# Altium schematic sheet Sheet1.SchDoc
size B; SheetNumber: 1; SheetTotal: 2
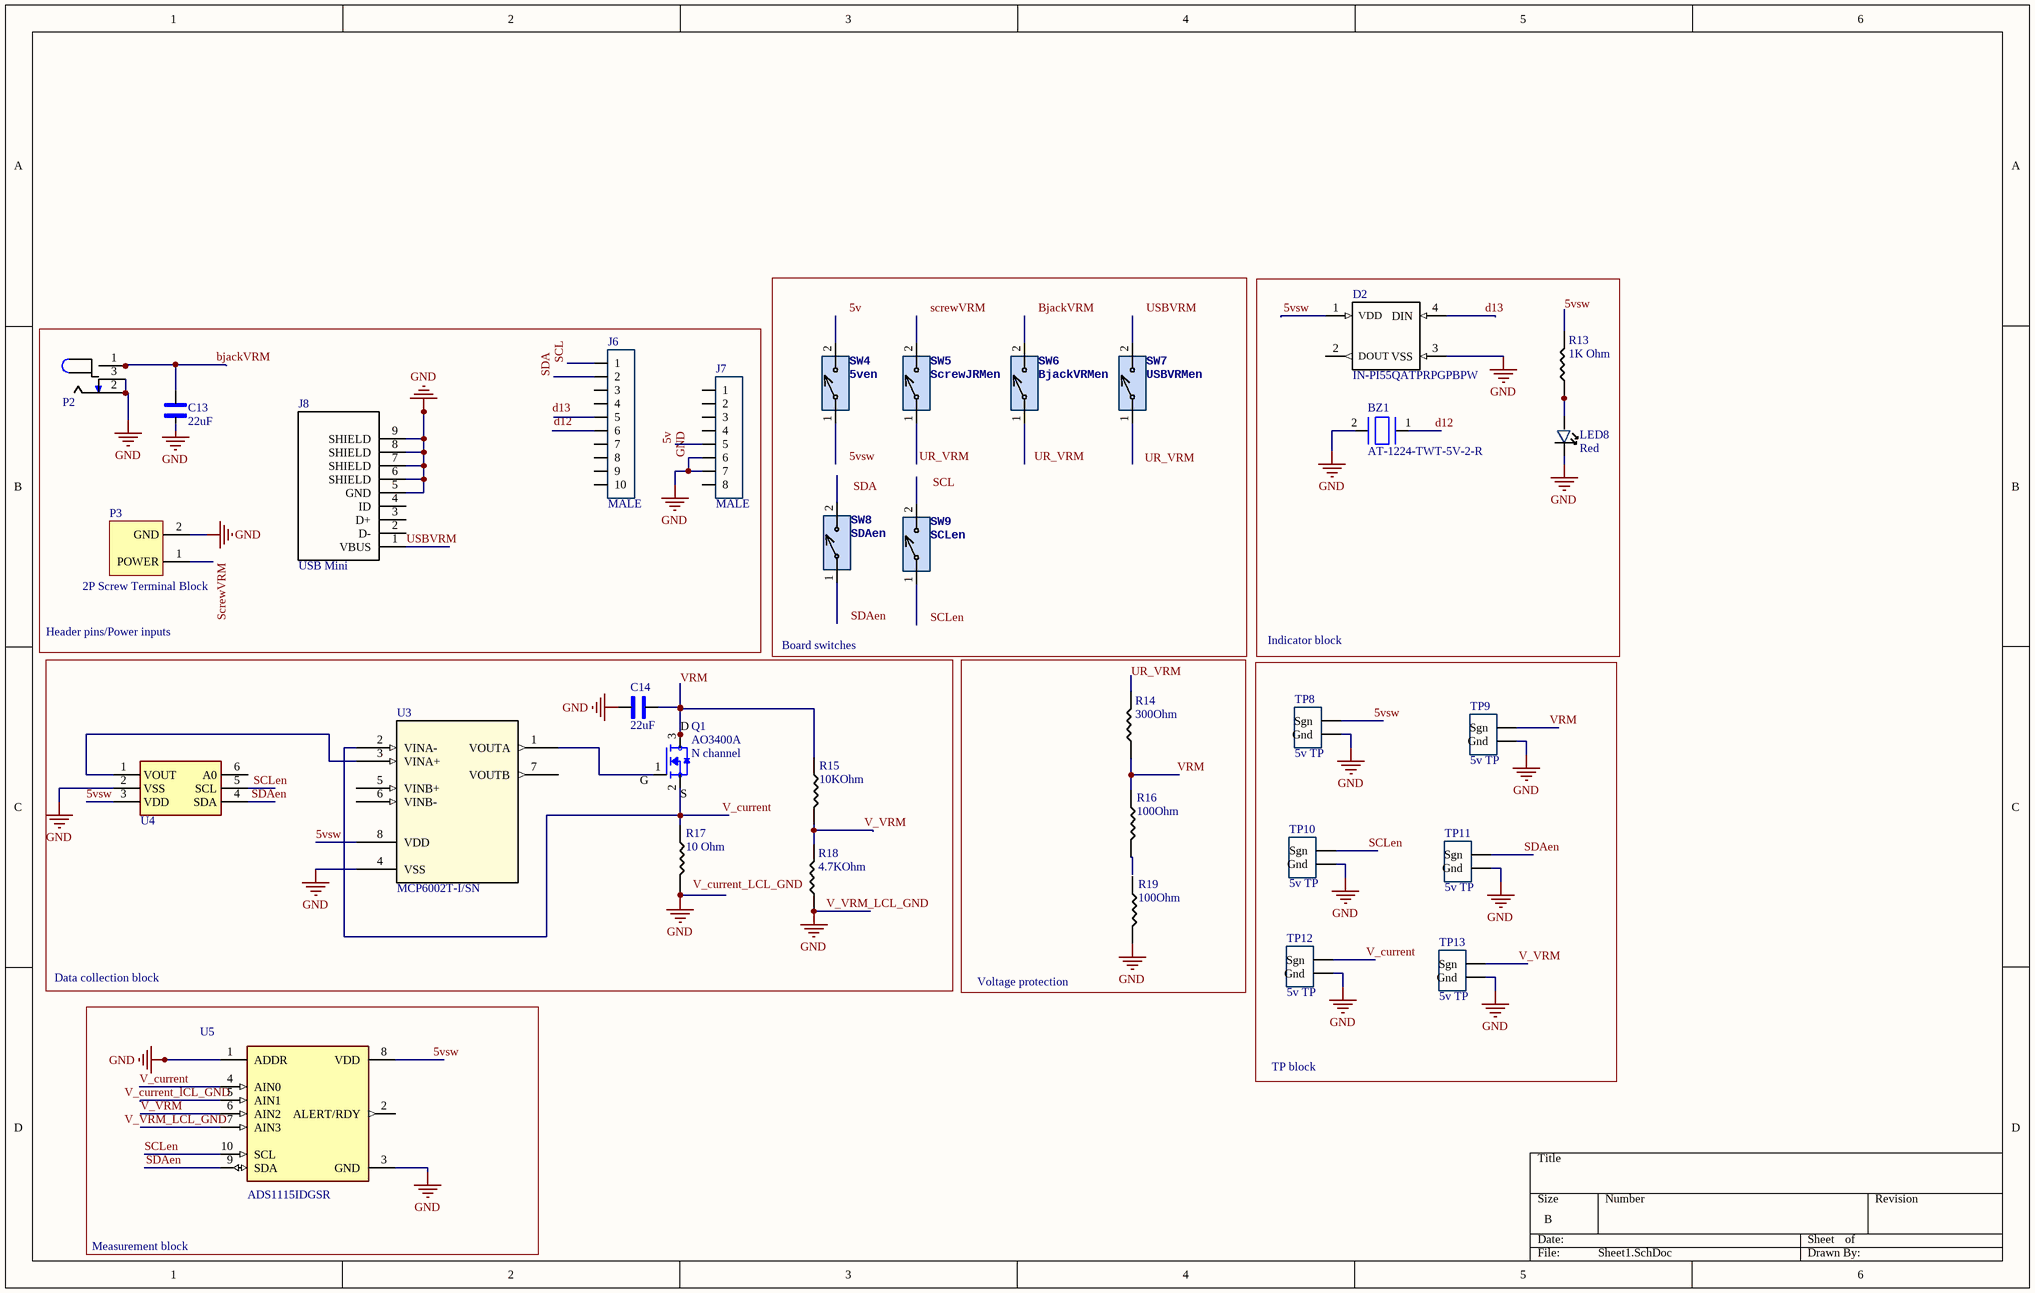
[diagram p0: Sheet1.SchDoc]

## Parts
BZ1  AT-1224-TWT-5V-2-R  [BUZZER- TH]
C13  22uF  [1206_Passive_Capacitor]
C14  22uF  [1206_Passive_Capacitor]
D2  IN-PI55QATPRPGPBPW  [SERIAL_LED - duplicate]
J6  value MALE  [10_PIN_100MIL-Male]  (hidden comment: MALE 10PIN)
J7  value MALE  [8_PIN_100MIL-Male]  (hidden comment: MALE 8PIN)
J8  USB Mini  [USB_MINI_B]
LED8  Red  [LED_1206]
P2  Power Jack  [Power_Jack]  (value not drawn)
P3  2P Screw Terminal Block  [P_Terminal block 3.5mm-pitch]
Q1  AO3400A  value N channel  [N-MOSFET]
R13  value 1K Ohm  [1206_Passive_Resitor]  (hidden comment: 1k)
R14  value 300Ohm  [1206_Passive_Resitor]  (hidden comment: 300 Ohm)
R15  value 10KOhm  [1206_Passive_Resitor]  (hidden comment: 10k)
R16  100Ohm  [1206_Passive_Resitor]
R17  10 Ohm  [1206_Passive_Resitor]
R18  4.7KOhm  [1206_Passive_Resitor]
R19  100Ohm  [1206_Passive_Resitor]
SW4  5ven  [2Pin-Header-Conn]
SW5  ScrewJRMen  [2Pin-Header-Conn]
SW6  BjackVRMen  [2Pin-Header-Conn]
SW7  USBVRMen  [2Pin-Header-Conn]
SW8  SDAen  [2Pin-Header-Conn]
SW9  SCLen  [2Pin-Header-Conn]
TP8  5v TP  [TP10x_Probe]
TP9  5v TP  [TP10x_Probe]
TP10  5v TP  [TP10x_Probe]
TP11  5v TP  [TP10x_Probe]
TP12  5v TP  [TP10x_Probe]
TP13  5v TP  [TP10x_Probe]
U3  MCP6002T-I/SN  [SOIC127P600X175-8N]
U4  DAC IC  [MCP4725]  (value not drawn)
U5  ADS1115IDGSR  [ADC_ADS1115IDGSR]

## Blocks framed on the sheet
Board switches: SW4-SW9
Indicator block: BZ1 D2 LED8 R13
Header pins/Power inputs: C13 J6-J8 P2 P3
Data collection block: C14 Q1 R15 R17 R18 U3 U4
Voltage protection: R14 R16 R19
TP block: TP8-TP13
Measurement block: U5

## Nets
GND: BZ1.2(BZ2) C13.1 C14.2 D2.3(VSS) J7.6 J7.7 J8.5(GND) J8.6(SHIELD) J8.7(SHIELD) J8.8(SHIELD) J8.9(SHIELD) LED8.2 P2.2 P2.3 P3.2(GND) R17.2 R18.1 R19.2 TP8.2(Gnd) TP9.2(Gnd) TP10.2(Gnd) TP11.2(Gnd) TP12.2(Gnd) TP13.2(Gnd) U3.4(VSS) U4.2(VSS) U5.1(ADDR) U5.3(GND)  [also labelled V_VRM_LCL_GND]
5v: J7.5
5vsw: D2.1(VDD) R13.2 TP8.1(Sgn) U3.8(VDD) U4.3(VDD) U5.8(VDD)
bjackVRM: C13.2 P2.1
d12: BZ1.1(BZ1)
d13: D2.4(DIN)
SCL: J6.1
SCLen: TP10.1(Sgn) U4.5(SCL) U5.10(SCL)
ScrewVRM: P3.1(POWER)
SDA: J6.2
SDAen: TP11.1(Sgn) U4.4(SDA) U5.9(SDA)
UR_VRM: R14.2
USBVRM: J8.1(VBUS)
V_current: Q1.2(S) R17.1 TP12.1(Sgn) U3.2(VINA-) U5.4(AIN0)
V_VRM: R15.2 R18.2 TP13.1(Sgn) U5.6(AIN2)
VRM: C14.1 Q1.3(D) R14.1 R15.1 R16.1 TP9.1(Sgn)
NetLED8_1: LED8.1 R13.1
NetQ1_1: Q1.1(G) U3.1(VOUTA)
NetU3_3: U3.3(VINA+) U4.1(VOUT)

Not connected (* = marked no-connect by the designer): D2 2(DOUT); J6 3 4 5 6 7 8 9 10; J7 1 2 3 4 8; J8 2(D-) 3(D+) 4(ID); R16 2; R19 1; SW4 1 2; SW5 1 2; SW6 1 2; SW7 1 2; SW8 1 2; SW9 1 2; U3 5(VINB+) 6(VINB-) 7(VOUTB); U4 6(A0); U5 2(ALERT/RDY) 5(AIN1) 7(AIN3)

## Notes on the sheet
- Labels drawn without touching a wire or pin: 5v, 5vsw, BjackVRM, d12, d13, SCL, SCLen, screwVRM, SDA, SDAen, UR_VRM, USBVRM, V_current_lCL_GND, V_current_LCL_GND, V_VRM_LCL_GND

## Library data of the parts
BZ1 = BUZZER_1: Buzzers Transducer, Externally Driven Electromechanical/Magnetic 5 V 40mA 2.4kHz 87dB @ 5V, 10cm Through Hole PC Pins; Datasheet: https://www.puiaudio.com/media/SpecSheet/AT-1224-TWT-5V-2-R.pdf; MFR Part #: AT-1224-TWT-5V-2-R
C13 C14 = C_22uF_1206: 22uF ±10% 25V X5R 1206 Multilayer Ceramic Capacitors MLCC - SMD/SMT RoHS; MFR Part #: CL31A226KAHNNNE; Type: basic; LCSC Part#: C12891; Datasheet: https://datasheet.lcsc.com/lcsc/1811031514_Samsung-Electro-Mechanics-CL31A226KAHNNNE_C12891.pdf; Value: 22uF
D2 = LED_Smart: LIGHT EMITTING DIODES (LED) RGB 620~630NM RED, 520~530NM GREEN, 465~475NM BLUE 600MCD@16MARED,1200MCD@16MAGREEN,300MCD@16MABLUE TOP VIEW SMD-4 ROHS; MFR Part #: XL-5050RGBC-WS2812B; Manufacturer: XINGLIGHT; LCSC Part#: C2843785; DataSheet: https://datasheet.lcsc.com/lcsc/2301111130_XINGLIGHT-XL-5050RGBC-WS2812B_C2843785.pdf
J6 = JM_10_PIN_MALE: Pin Header 10 1 Straight ，180degrees 2.54mm Through Hole,P=2.54mm Pin Header & Female Header RoHS; LCSC Part#: C124372; Type: Extended; Datasheet: https://datasheet.lcsc.com/szlcsc/1810241611_Ckmtw-Shenzhen-Cankemeng-C124372_C124372.pdf
J7 = JM_8_PIN_MALE: Pin Header 8 1 right-angle，180degrees 2.54mm Through Hole,P=2.54mm Pin Header & Female Header RoHS; LCSC Part#: C492407; Datasheet: https://datasheet.lcsc.com/szlcsc/2003191006_XFCN-PZ254V-11-08P_C492407.pdf; Type: Extended
J8 = J_USB_B_Mini: Through Hole USB Connectors RoHS; MFR Part #: 920-462A2021D10102; Value: USB mini B; LCSC Part#: C46398; Datasheet: https://datasheet.lcsc.com/szlcsc/2103081233_Jing-Extension-of-the-Electronic-Co-920-462A2021D10102_C46398.pdf; Type: Extended
LED8 = LED_RED_1206: Red 621~631nm 1206 Light Emitting Diodes (LED) RoHS; MFR Part #: 15-21/R6C-FQ1R1B/2T; Type: Extended; LCSC Part#: C93133; Datasheet: https://datasheet.lcsc.com/szlcsc/1811151241_Everlight-Elec-15-21-R6C-FQ1R1B-2T_C93133.pdf; Value: Red
P2 = P_Power Jack: Power Barrel Connector Jack 2.10mm ID (0.083"), 5.50mm OD (0.217") Through Hole, Right Angle; MFR Part #: PJ-102A; Value: CONN PWR JACK 2X5.5MM SOLDER; Digikey Link: https://www.digikey.com/product-detail/en/PJ-102A/CP-102A-ND/275425/?itemSeq=304982367; LCSC Part#: C136744; Type: Extended
P3 = P_Terminal block: Green Straight pin 3.5mm  pitch; P=3.5mm  Screw terminal ROHS; MFR Part #: KF350-3.5-2P; Manufacturer: Cixi Kefa Elec; LCSC Part#: C474892; DataSheet: https://datasheet.lcsc.com/lcsc/2001160007_Cixi-Kefa-Elec-KF350-3-5-2P_C474892.pdf
Q1 = Q_Nch_MOSFET: MOSFET N Trench 30V 5.7A 1.5V @ 250uA 26.5 m? @ 5.7A,10V SOT-23-3L RoHS; Type: Basic; LCSC Part#: C20917; Datasheet: https://datasheet.lcsc.com/szlcsc/Alpha-Omega-Semicon-AOS-AO3400A_C20917.pdf; MFR Part #: AO3400A
R13 = R_1K_1206: CHIP RESISTOR - SURFACE MOUNT 1KOHMS ±1% 1/4W 1206 ROHS; MFR Part #: RNCP1206FTD1K00CT; Digikey Link: https://www.digikey.com/product-detail/en/RNCP1206FTD1K00/RNCP1206FTD1K00CT-ND/2240675/?itemSeq=304982373; LCSC Part#: C4410; Type: Basic
R14 = R_300Ohm_1206: CHIP RESISTOR - SURFACE MOUNT 300OHMS ±1% 1/4W 1206 ROHS; MFR Part #: 1206W4F3000T5E; Datasheet: https://datasheet.lcsc.com/szlcsc/Uniroyal-Elec-1206W4F3000T5E_C17887.pdf; LCSC Part#: C17887; Type: Basic
R15 = R_10KOhm_1206: 10 kOhms ±5% 0.25W, 1/4W Chip Resistor 1206 (3216 Metric) Automotive AEC-Q200 Thick Film; MFR Part #: RMCF1206FT10K0; Digikey Link: https://www.digikey.com/en/products/detail/stackpole-electronics-inc/RMCF1206FT10K0/1759669; LCSC Part#: C17902; Type: Basic
R16 R19 = R_100Ohm_1206: 100Ω ±1% 0.25W ±100ppm/℃ 1206 Chip Resistor - Surface Mount RoHS; MFR Part #: 1206W4F1000T5E; LCSC Part#: C17901; Datasheet: https://datasheet.lcsc.com/lcsc/2206010145_UNI-ROYAL-Uniroyal-Elec-1206W4F1000T5E_C17901.pdf; Type: Basic; Value: 100Ohm
R17 = R_10Ohm_1206: CHIP RESISTOR - SURFACE MOUNT 0.1OHMS ±1% 1/4W 1206 ROHS; MFR Part #: 1206W4F100JT5E; Datasheet: https://datasheet.lcsc.com/szlcsc/Uniroyal-Elec-1206W4F100JT5E_C17903.pdf; LCSC Part#: C17903; Type: Basic; Value: 10 Ohm
R18 = R_4.7k_1206: 4.7kΩ ±1% 0.25W ±100ppm/℃ 1206 Chip Resistor - Surface Mount RoHS; MFR Part #: 1206W4F4701T5E; LCSC Part#: C17936; Datasheet: https://datasheet.lcsc.com/lcsc/1810301414_UNI-ROYAL-Uniroyal-Elec-1206W4F4701T5E_C17936.pdf; Type: Basic; Value: 4.7KOhm
SW4-SW9 = SW_2Pin_100mil_Switch: 2Pin Header; LCSC Part#: C124375; Type: Extended
TP8-TP13 = TP_10x_Probe: Test Point 300 mil centers
U3 = U_MCP6002T-I/SN: 0.6 V/us 2 1MHz 1.8V ~ 6V 100μA General Purpose SOIC-8_150mil  Operational Amplifier ROHS; Mfr: Microchip; MFR Part #: MCP6002T-I/SN; DataSheet: https://ww1.microchip.com/downloads/en/DeviceDoc/MCP6001-1R-1U-2-4-1-MHz-Low-Power-Op-Amp-DS20001733L.pdf; LCSC Part#: C7377; Type: Basic
U4 = U_MCP4725A0T-E/CH: IC DAC 12BIT V-OUT SOT23-6; Datasheet: https://ww1.microchip.com/downloads/en/DeviceDoc/22039d.pdf; LCSC Part#: C144198; type: Extended; MFR Part #: MCP4725A0T-E/CH
U5 = U_ADC_ADS1115IDGSR: 16-Bit ADC with Integrated MUX, PGA, Comparator, Oscillator, and Reference 10-VSSOP -40 to 125; MFR Part #: ADS1115IDGSR; Package: MSOP-10 Texas Instruments; LCSC Part#: C37593; SnapEDA_Link: https://www.snapeda.com/parts/ADS1115IDGSR/Texas%20Instruments/view-part/?ref=snap; Type: Extended; DigiKey link: https://www.digikey.com/product-detail/en/texas-instruments/ADS1115IDGSR/296-38849-1-ND/5142969?utm_source=snapeda&utm_medium=aggregator&utm_campaign=symbol; Value: *